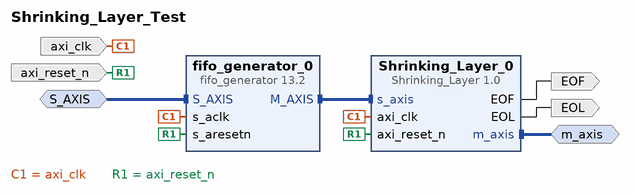
[diagram p0: block diagram of the top level]
# Vivado block design Shrinking_Layer_Test, xczu9eg-ffvb1156-2-e, Vivado 2023.1
create_bd_design Shrinking_Layer_Test

create_bd_intf_port -mode Slave -vlnv xilinx.com:interface:axis_rtl:1.0 S_AXIS
set_property -dict [list \
  CONFIG.FREQ_HZ 300000000 \
  CONFIG.HAS_TKEEP 0 \
  CONFIG.HAS_TLAST 0 \
  CONFIG.HAS_TREADY 1 \
  CONFIG.HAS_TSTRB 0 \
  CONFIG.LAYERED_METADATA undef \
  CONFIG.TDATA_NUM_BYTES 16 \
  CONFIG.TDEST_WIDTH 0 \
  CONFIG.TID_WIDTH 0 \
  CONFIG.TUSER_WIDTH 4 \
] [get_bd_intf_ports S_AXIS]
create_bd_intf_port -mode Master -vlnv xilinx.com:interface:axis_rtl:1.0 m_axis
set_property -dict {CONFIG.FREQ_HZ 300000000} [get_bd_intf_ports m_axis]
create_bd_port -dir I -type clk axi_clk
set_property -dict {CONFIG.ASSOCIATED_BUSIF S_AXIS:m_axis CONFIG.FREQ_HZ 300000000} [get_bd_ports axi_clk]
create_bd_port -dir I -type rst axi_reset_n
create_bd_port -dir O EOL
create_bd_port -dir O EOF

create_bd_cell -type ip -vlnv xilinx.com:ip:fifo_generator:13.2 fifo_generator_0
set_property -dict [list \
  CONFIG.FIFO_Implementation_axis Common_Clock_Block_RAM \
  CONFIG.INTERFACE_TYPE AXI_STREAM \
  CONFIG.TDATA_NUM_BYTES 16 \
  CONFIG.Use_Embedded_Registers_axis false \
] [get_bd_cells fifo_generator_0]
create_bd_cell -type ip -vlnv xilinx.com:user:Shrinking_Layer:1.0 Shrinking_Layer_0

# ---- connections ----

connect_bd_intf_net [get_bd_intf_pins fifo_generator_0/S_AXIS] [get_bd_intf_ports S_AXIS]
connect_bd_intf_net [get_bd_intf_pins Shrinking_Layer_0/m_axis] [get_bd_intf_ports m_axis]
connect_bd_intf_net [get_bd_intf_pins Shrinking_Layer_0/s_axis] [get_bd_intf_pins fifo_generator_0/M_AXIS]
connect_bd_net [get_bd_pins Shrinking_Layer_0/EOF] [get_bd_ports EOF]
connect_bd_net [get_bd_pins Shrinking_Layer_0/EOL] [get_bd_ports EOL]
connect_bd_net [get_bd_ports axi_clk] [get_bd_pins fifo_generator_0/s_aclk] [get_bd_pins Shrinking_Layer_0/axi_clk]
connect_bd_net [get_bd_ports axi_reset_n] [get_bd_pins fifo_generator_0/s_aresetn] [get_bd_pins Shrinking_Layer_0/axi_reset_n]

validate_bd_design
save_bd_design
